# Altium schematic sheet stm32.SchDoc
size A
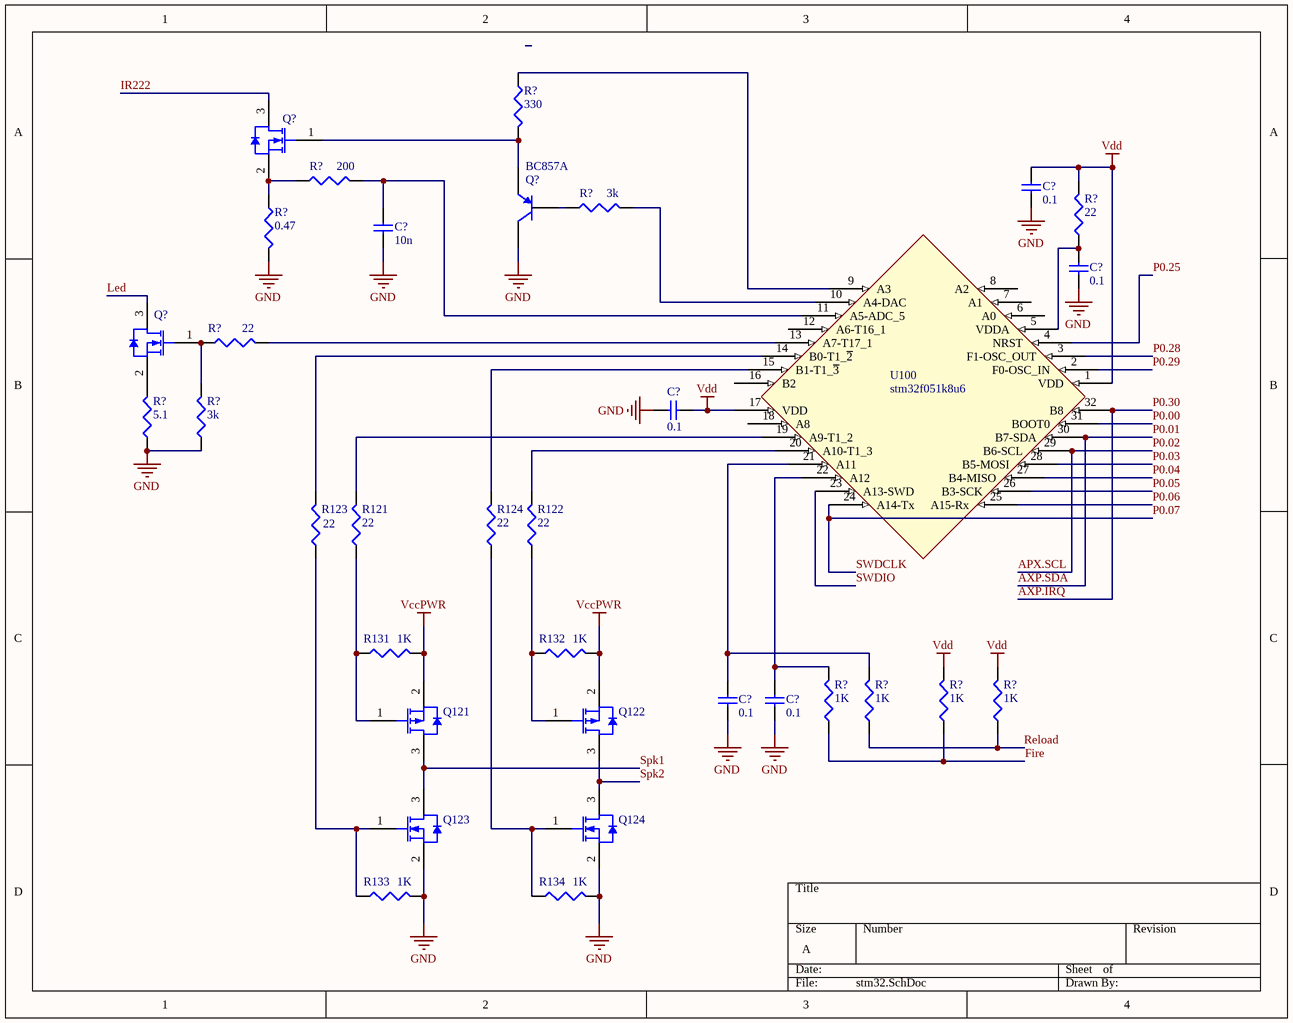
[diagram p0: stm32.SchDoc]

## Parts
(Parts that share a designator on the sheet are numbered #1, #2 ... from top to bottom, then left to right.)
C?#1  0.1  [CAPC1608X06L]
C?#2  10n  [CAPC1608X06L]
C?#3  0.1  [CAPC1608X06L]
C?#4  0.1  [CAPC1608X06L]
C?#5  0.1  [CAPC1608X06L]
C?#6  0.1  [CAPC1608X06L]
Q121  (no value)  [INF-PG-SOT23_N]
Q122  (no value)  [INF-PG-SOT23_N]
Q123  (no value)  [INF-PG-SOT23_N]
Q124  (no value)  [INF-PG-SOT23_N]
Q?#1  (no value)  [INF-PG-SOT23_N]
Q?#2  BC857A  [INF-SOT23_N]
Q?#3  (no value)  [INF-PG-SOT23_N]
R121  value 22  [J1-0603]
R122  value 22  [J1-0603]
R123  value 22  [J1-0603]
R124  value 22  [J1-0603]
R131  value 1K  [J1-0603]
R132  value 1K  [J1-0603]
R133  value 1K  [J1-0603]
R134  value 1K  [J1-0603]
R?#1  value 330  [J1-0603]
R?#2  value 200  [J1-0603]
R?#3  value 3k  [J1-0603]
R?#4  value 22  [J1-0603]
R?#5  value 0.47  [J1-0603]
R?#6  value 22  [J1-0603]
R?#7  value 5.1  [J1-0603]
R?#8  value 3k  [J1-0603]
R?#9  value 1K  [J1-0603]
R?#10  value 1K  [J1-0603]
R?#11  value 1K  [J1-0603]
R?#12  value 1K  [J1-0603]
U100  stm32f051k8u6  [stm32f051k8u6]

## Nets
GND: C?#1.1 C?#2.1 C?#3.1 C?#4.2 C?#5.1 C?#6.1 Q123.2(SOURCE) Q124.2(SOURCE) Q?#2.3(C) R133.2 R134.2 R?#5.1 R?#7.1 R?#8.1
VccPWR: Q121.2(SOURCE) Q122.2(SOURCE) R131.2 R132.2
Vdd: C?#1.2 C?#4.1 R?#4.2 R?#11.2 R?#12.2 U100.1(VDD) U100.17(VDD)
APX.SCL: U100.29(B6-SCL)  [also labelled P0.02]
AXP.IRQ: U100.32(B8)  [also labelled P0.30]
AXP.SDA: U100.30(B7-SDA)  [also labelled P0.01]
Fire: R?#9.1 R?#11.1
IR222: Q?#1.3(DRAIN)
Led: Q?#3.3(DRAIN)
P0.00: U100.31(BOOT0)
P0.03: U100.28(B5-MOSI)
P0.04: U100.27(B4-MISO)
P0.05: U100.26(B3-SCK)
P0.06: U100.25(A15-Rx)
P0.07: U100.24(A14-Tx)  [also labelled SWDCLK]
P0.25: U100.4(NRST)
P0.28: U100.3(F1-OSC_OUT)
P0.29: U100.2(F0-OSC_IN)
Reload: R?#10.1 R?#12.1
Spk1: Q121.3(DRAIN) Q123.3(DRAIN)
Spk2: Q122.3(DRAIN) Q124.3(DRAIN)
SWDIO: U100.23(A13-SWD)
NetC?#2_2: C?#2.2 R?#2.1 U100.11(A5-ADC_5)
NetC?#3_2: C?#3.2 R?#4.1 U100.5(VDDA)
NetC?#5_2: C?#5.2 R?#10.2 U100.21(A11)
NetC?#6_2: C?#6.2 R?#9.2 U100.22(A12)
NetQ121_1: Q121.1(GATE) R121.1 R131.1
NetQ122_1: Q122.1(GATE) R122.1 R132.1
NetQ123_1: Q123.1(GATE) R123.1 R133.1
NetQ124_1: Q124.1(GATE) R124.1 R134.1
NetQ?#1_1: Q?#1.1(GATE) Q?#2.2(E) R?#1.1
NetQ?#1_2: Q?#1.2(SOURCE) R?#2.2 R?#5.2
NetQ?#2_1: Q?#2.1(B) R?#3.2
NetQ?#3_1: Q?#3.1(GATE) R?#6.1 R?#8.2
NetQ?#3_2: Q?#3.2(SOURCE) R?#7.2
NetR121_2: R121.2 U100.19(A9-T1_2)
NetR122_2: R122.2 U100.20(A10-T1_3)
NetR123_2: R123.2 U100.14(B0-T1_~{2})
NetR124_2: R124.2 U100.15(B1-T1_~{3})
NetR?#1_2: R?#1.2 U100.9(A3)
NetR?#3_1: R?#3.1 U100.10(A4-DAC)
NetR?#6_2: R?#6.2 U100.13(A7-T17_1)

Not connected (* = marked no-connect by the designer): U100 6(A0) 7(A1) 8(A2) 12(A6-T16_1) 16(B2) 18(A8)

## Library data of the parts
C?#1 C?#3-C?#6 = CAP_0603: Capacitor, X5R, ±10%; Part Number: C0603-4µ7; Note: 6.3V; Artikkelnr Noca: 20069060; Artikkelnr Simpro: N.A.; Manufacturer: *; Manufacturer Part Number: *; Datasheet: *; LatestRevisionDate: 2009-11-23; Pin Count: 2; Publisher: Nordic Semiconductor; Published: 2009-05-08; Value: 0.1; Supplier: *; Supplier part number: *; 2nd source Supplier: *; 2nd source part number: *; Footprint Doc: 0603
C?#2 = CAP_0603: Capacitor, X5R, ±10%; Part Number: C0603-4µ7; Value: 0.1; Note: 6.3V; Artikkelnr Noca: 20069060; Artikkelnr Simpro: N.A.; Manufacturer: *; Manufacturer Part Number: *; Datasheet: *; LatestRevisionDate: 2009-11-23; Pin Count: 2; Publisher: Nordic Semiconductor; Published: 2009-05-08; Supplier: *; Supplier part number: *; 2nd source Supplier: *; 2nd source part number: *; Footprint Doc: 0603
Q121 Q122 = BSS215P H6327: P-Channel OptiMOS P2 Small-Signal-Transistor, -20 V VDS, -1.5 A ID, -55 to 150 degC, PG-SOT23, Reel, Green; Manufacturer: Infineon; Green: TRUE; ID (max): -1.5 A; IDpuls (max): -6 A; Pto t (max): 0.5 W; QG: -3.6 nC; RDS (on) (max): 280 mOhm; RDS (on) (max) (@4.5V): 150 mOhm; Rth: 250 K/W; VDS (max): -20 V; VGS(th) (max): -0.6 V; VGS(th) (min): -1.2 V; DatasheetVersion: Rev. 2.3; PackageVersion: Apr-08; PackageReference: PG-SOT23; PackageDescription: 3-Pin Small Outline Transistor Package, 2.9 x 1.3 mm Body, 0.95 mm Pitch; Supplier 1: Digi-Key; Supplier Part Number 1: BSS215P H6327TR-ND; Supplier 2: Digi-Key; Supplier Part Number 2: BSS215P H6327CT-ND; Supplier 3: Digi-Key; Supplier Part Number 3: BSS215P H6327DKR-ND; Halogen-free: TRUE; Packing: Reel; RDS (on) (max) (@2.5V): 280 mOhm; Mounting Technology: Surface Mount; PartNumber: BSS215P H6327; ComponentLink1Description: Manufacturer URL; ComponentLink1URL: http://www.infineon.com/; ComponentLink2Description: Datasheet; ComponentLink2URL: http://www.infineon.com/dgdl/BSS215P_Rev2.3.pdf?folderId=db3a304314dca38901154a72e3951a65&fileId=db3a304330f6860601311833f57144fb; ComponentLink3Description: Package Specification; ComponentLink3URL: http://www.infineon.com/dgdl/SOT23-Package_Overview.pdf?folderId=db3a30431936bc4b0119532290053c66&fileId=db3a30431936bc4b0119533468123c85
Q123 Q124 Q?#1 Q?#3 = BSS806N: N-Channel OptiMOS 2 Small-Signal-Transistor, 20 V VDS, 2.3 A ID, -55 to 150 degC, PG-SOT23, Reel, Green; Manufacturer: Infineon; Green: TRUE; ID (max): 2.3 A; IDpuls (max): 9.3 A; Ptot (max): 0.5 W; QG: 1.7 nC; RDS (on) (max): 57 mOhm; RDS (on) (max) (@1.8V): 82 mOhm; RthJA (max): 250 K/W; VDS (max): 20 V; VGS(th) (max): 0.75 V; VGS(th) (min): 0.3 V; DatasheetVersion: Rev. 2.3; PackageVersion: Apr-08; PackageReference: PG-SOT23; PackageDescription: 3-Pin Small Outline Transistor Package, 2.9 x 1.3 mm Body, 0.95 mm Pitch; Halogen-free: TRUE; Packing: Reel; RDS (on) (max) (@2.5V): 57 mOhm; Mounting Technology: Surface Mount; PartNumber: BSS806N; ComponentLink1Description: Manufacturer URL; ComponentLink1URL: http://www.infineon.com/; ComponentLink2Description: Datasheet; ComponentLink2URL: http://www.infineon.com/dgdl/BSS806N_Rev2.3_.pdf?folderId=db3a3043156fd573011622e10b5c1f67&fileId=db3a304330f686060131185f0553451c; ComponentLink3Description: Package Specification; ComponentLink3URL: http://www.infineon.com/dgdl/SOT23-Package_Overview.pdf?folderId=db3a30431936bc4b0119532290053c66&fileId=db3a30431936bc4b0119533468123c85
Q?#2 = BC857A: PNP Silicon AF Transistor, 45 V VCEO, 100 mA IC, SOT23, Reel, Green; Manufacturer: Infineon; fT (typ): 250 MHz; Green: TRUE; IBM (max): 200 mA; IC (max): 100 mA; ICBO (max): 15 nA; Ptot (max): 330 mW; VCBO (max): 50 V; VCEO (max): 45 V; VEBO (max): 5 V; PackageVersion: Apr-08; PackageReference: SOT23; PackageDescription: 3-Pin Small Outline Transistor Package, 1.3 x 2.9 mm Body, 0.95 mm Pitch; ICM (max): 200 mA; Packing: Reel; Polarity: PNP; Mounting Technology: Surface Mount; PartNumber: BC857A; ComponentLink1Description: Manufacturer URL; ComponentLink1URL: http://www.infineon.com/; ComponentLink2Description: Datasheet; ComponentLink2URL: http://www.infineon.com/dgdl/bc857series_bc858series_bc859series_bc860series.pdf?folderId=db3a304314dca389011541d30fa21656&fileId=db3a304314dca389011541da0e3a1661; ComponentLink3Description: Package Specification; ComponentLink3URL: http://www.infineon.com/dgdl/SOT23-Package_Overview.pdf?folderId=db3a30431936bc4b0119532290053c66&fileId=db3a30431936bc4b0119533468123c85
R121-R124 R131-R134 R?#1-R?#12 = Res3: Resistor; Published: 8-Jun-2000; LatestRevisionDate: 29-May-2009; LatestRevisionNote: IPC-7351 Footprint Added.; PackageReference: J1-0603; Publisher: Altium Limited; PackageDescription: Chip Resistor